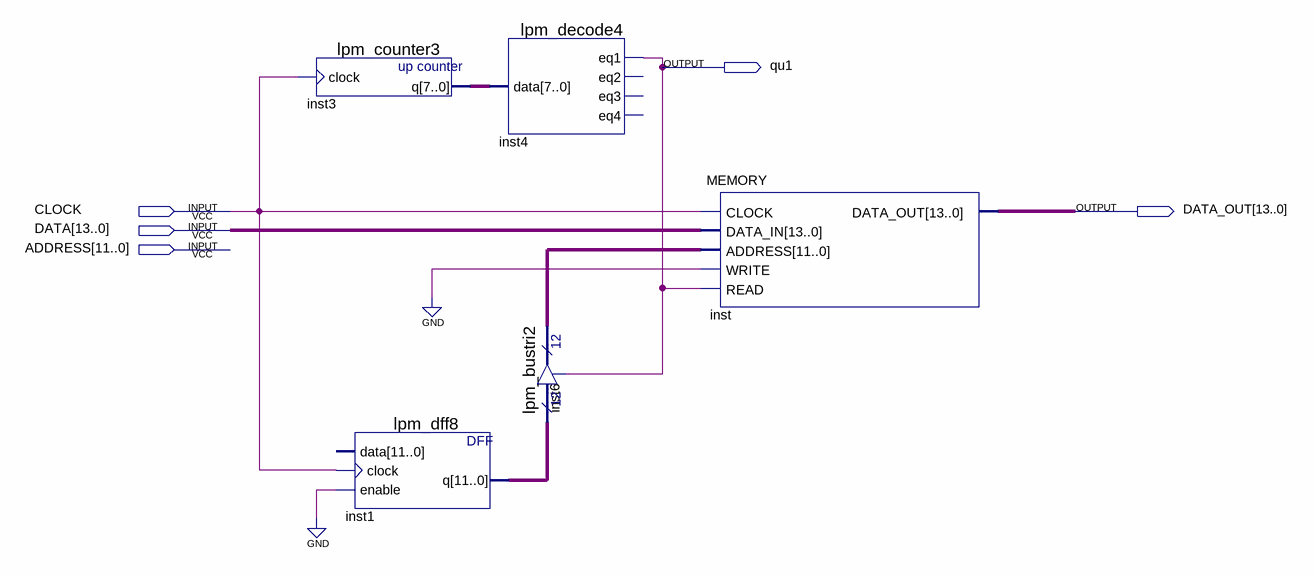
[diagram p0: schematic sheet]
// Quartus schematic T.bdf as structural Verilog: 5 symbols, 5 pins
module T (
  input  CLOCK,
  input  [13:0] DATA,
  input  [11:0] ADDRESS,
  output qu1,
  output [13:0] DATA_OUT
);

  wire [7:0] inst3_q;
  wire [11:0] inst1_q, inst6_tridata;

  lpm_counter3 inst3 (.clock(CLOCK), .q(inst3_q));
  lpm_dff8 inst1 (.clock(CLOCK), .enable(1'b0), .q(inst1_q));  // open: data
  lpm_decode4 inst4 (.data(inst3_q), .eq1(qu1));  // open: eq2, eq3, eq4
  lpm_bustri2 inst6 (.enabledt(qu1), .data(inst1_q), .tridata(inst6_tridata));
  MEMORY inst (.CLOCK(CLOCK), .DATA_IN(DATA), .ADDRESS(inst6_tridata), .WRITE(1'b0), .READ(qu1), .DATA_OUT(DATA_OUT));
endmodule
